# EasyEDA Pro project ProPrj_picoballoon-tracker_2025-08-19.epro

# Schematic Schematic1
Board Name: Board1; Create Date: 2025-05-16; Page Name: P1; Project Name: picoballoon-tracker; Schematic Name: Schematic1; Update Date: 2025-06-14; Company: EasyEDA.com; Page Size: A4; Version: V1.0
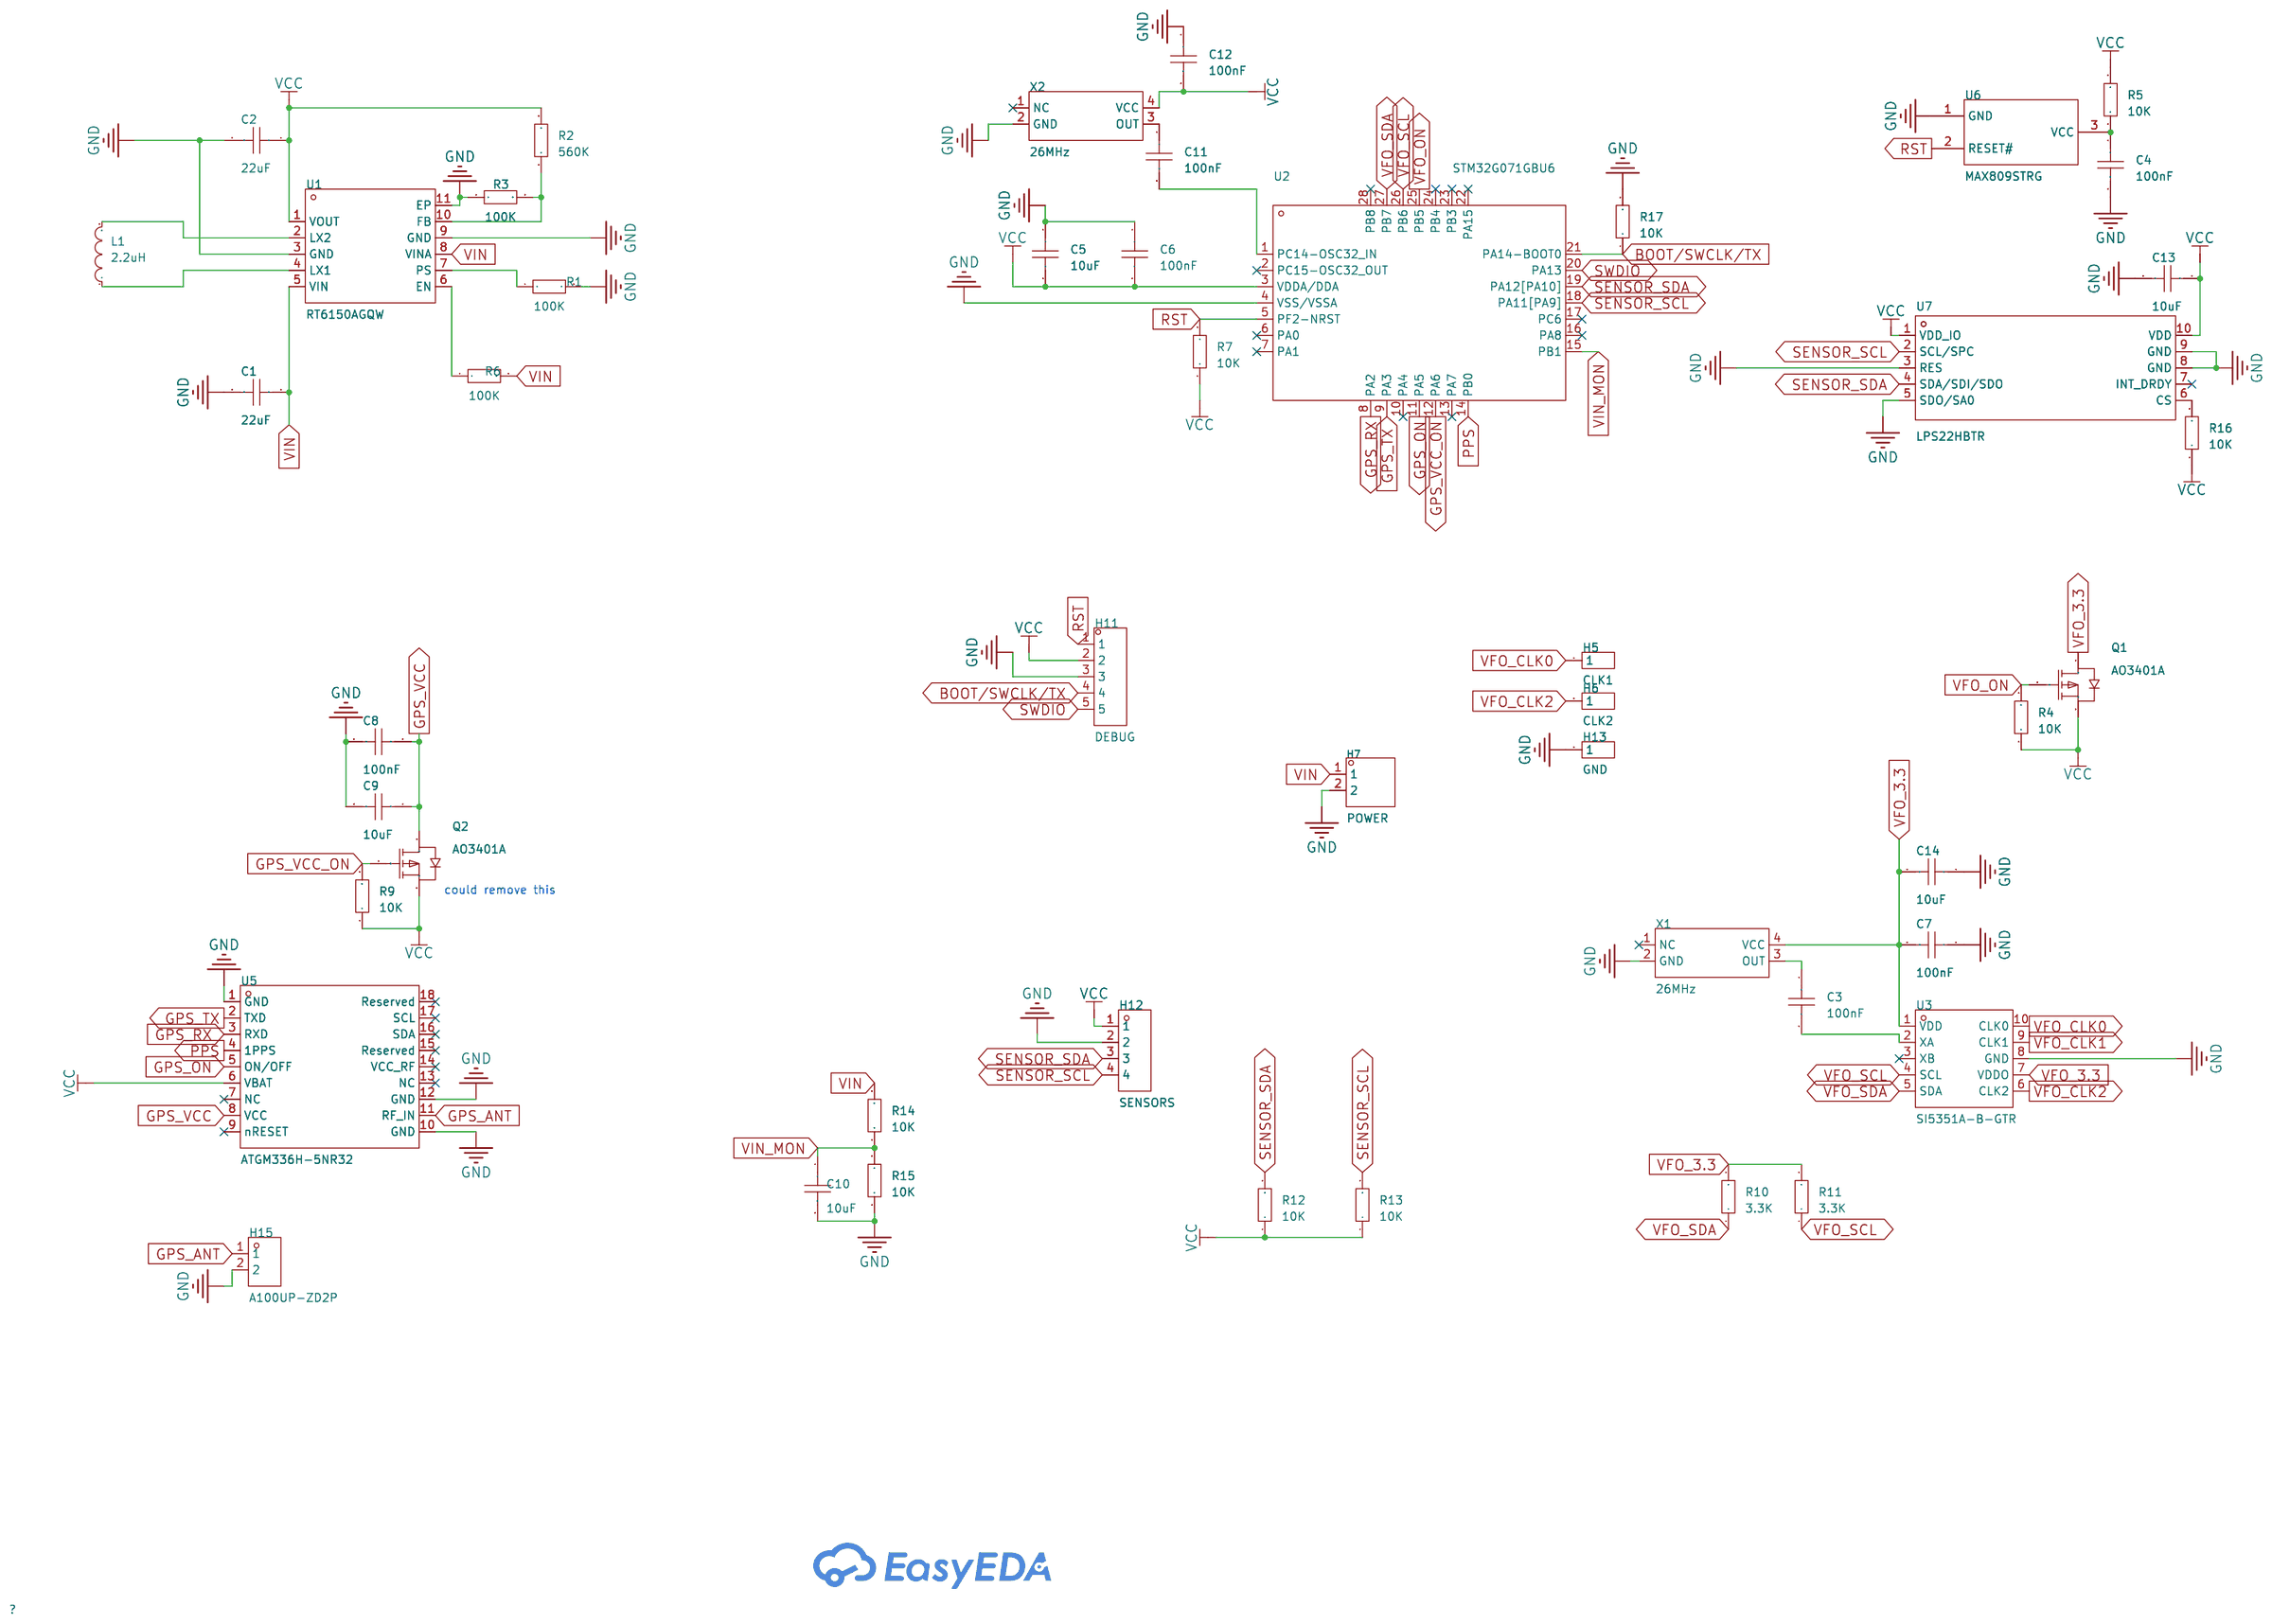
[diagram p0: schematic sheet]

## Parts
C1  22uF  [C0603]
C2  22uF  [C0603]
C3  100nF  [C0402]
C4  100nF  [C0402]
C5  10uF  [C0402]
C6  100nF  [C0402]
C7  100nF  [C0402]
C8  100nF  [C0402]
C9  10uF  [C0402]
C10  10uF  [C0402]
C11  100nF  [C0402]
C12  100nF  [C0402]
C13  10uF  [C0402]
C14  10uF  [C0402]
H5  CLK1  [HDR-TH_1P-V-M_XKB_X4611WV-01I-C28D40]
H6  CLK2  [HDR-TH_1P-V-M_XKB_X4611WV-01I-C28D40]
H7  POWER  [HDR-TH_2P-P2.54-V-M-1]
H11  DEBUG  [HDR-TH_5P-P2.54-V-M]
H12  SENSORS  [HDR-TH_ZX-PZ1.0-1-4PZZ]
H13  GND  [HDR-TH_1P-V-M_XKB_X4611WV-01I-C28D40]
H15  A100UP-ZD2P  [HDR-TH_2P-P1.00-V-M]
L1  2.2uH  [L0805]
Q1  AO3401A  [SOT-23_L2.9-W1.3-P1.90-LS2.4-BR]
Q2  AO3401A  [SOT-23_L2.9-W1.3-P1.90-LS2.4-BR]
R1  100K  [R0402]
R2  560K  [R0603]
R3  100K  [R0603]
R4  10K  [R0402]
R5  10K  [R0402]
R6  100K  [R0402]
R7  10K  [R0402]
R9  10K  [R0402]
R10  3.3K  [R0402]
R11  3.3K  [R0402]
R12  10K  [R0402]
R13  10K  [R0402]
R14  10K  [R0402]
R15  10K  [R0402]
R16  10K  [R0402]
R17  10K  [R0603]  (no BOM)
U1  RT6150AGQW  [WDFN-10_L3.0-W3.0-P0.50-BL-EP]
U2  STM32G071GBU6  [UFQFPN-28_L4.0-W4.0-P0.50-BL]
U3  SI5351A-B-GTR  [MSOP-10_L3.0-W3.0-P0.50-LS5.0-BL]
U5  ATGM336H-5NR32  [GPS-SMD_18P-L10.1-W9.7-P1.10-TL]
U6  MAX809STRG  [SOT-23-3_L2.9-W1.6-P1.90-LS2.8-BR]
U7  LPS22HBTR  [HLGA-10L_LPS22HBTR]
X1  26MHz  [OSC-SMD_4P-L2.5-W2.0-BL_X1G0042110003]
X2  26MHz  [OSC-SMD_4P-L2.5-W2.0-BL_X1G0042110003]

## Library data of the parts
C1 C2 = CAP_0603: Supplier Footprint: 0603
C3-C14 = CAP_0402: Supplier Part: C1525; Supplier Footprint: 0402
H5 H6 H13 = HDR-M_2.54_1x1P: Supplier Footprint: Through
H7 = HDR-M_2.54_1x2P: Supplier Footprint: Through
H11 = HDR-M_2.54_1x5P: Supplier Footprint: Through
H12 = ZX-PZ1.0-1-4PZZ: Pin Structure:1x4P Pitch:1mm Row Spacing:- Circluar Pins/Square Pins:Policy Mounting Type:Straight Number of Rows:Single Row Number of Pins:4P Current Rating:0.75A Length of Mating Pin:2mm Insulation Height:1mm Length of End Connection Pin:2mm Contact Mat; LCSC Part Name: 1x4P 间距:1mm 方针 直插; Supplier Part: C37328854; Manufacturer: Megastar(兆星); Supplier Footprint: 插件,P=1mm; JLCPCB Part Class: Extended Part; Datasheet: https://atta.szlcsc.com/upload/public/pdf/source/20240812/85F48A99F7C6AED78605DAA33CDE8A90.pdf; Supplier: LCSC; Pin Structure: 1x4P; Pitch: 1mm; Circluar Pins/Square Pins: Policy; Mounting Type: Straight; Number of Rows: Single Row; Number of Pins: 4P; Current Rating: 0.75A; Length of Mating Pin: 2mm; Insulation Height: 1mm; Length of End Connection Pin: 2mm; Contact Material: Brass; Contact Plating: Gold; Operating Temperature: -40℃~+105℃; Color: Black
H15 = A100UP-ZD2P: Pin Structure:1x2P Pitch:1mm Row Spacing:- Circluar Pins/Square Pins:Policy Number of Rows:Single Row Number of Pins:2P Current Rating:0.75A Length of Mating Pin:2mm Insulation Height:1mm Operating Temperature:-40℃~+105℃ Operating Temperature:-40℃~+105℃; LCSC Part Name: 1x2P 间距:1mm 方针; Supplier Part: C32713045; Manufacturer: BXCONN(宝讯); Supplier Footprint: 插件,P=1mm; JLCPCB Part Class: Extended Part; Datasheet: https://atta.szlcsc.com/upload/public/pdf/source/20240723/7827636EC4017AF937C0598DF75E6B3B.pdf; Supplier: LCSC; Pin Structure: 1x2P; Pitch: 1mm; Circluar Pins/Square Pins: Policy; Number of Rows: Single Row; Number of Pins: 2P; Current Rating: 0.75A; Length of Mating Pin: 2mm; Insulation Height: 1mm; Operating Temperature: -40℃~+105℃
L1 = L_0805
Q1 Q2 = AO3401A_C15127: Type:1 Piece P-Channel Drain Source Voltage (Vdss): Continuous Drain Current (Id): Drain Source On Resistance (RDS(on)@Vgs,Id):44mΩ@10V,4.3A Power Dissipation (Pd): Gate Threshold Voltage (Vgs(th)@Id):1.3V@250uA Total Gate Charge (Qg@Vgs):12.2nC@4.5V Inpu; LCSC Part Name: 1个P沟道 耐压:30V 电流:4A; Supplier Part: C15127; Manufacturer: AOS; Supplier Footprint: SOT-23; JLCPCB Part Class: Basic Part; Datasheet: https://atta.szlcsc.com/upload/public/pdf/source/20160507/1462613609053.pdf; Supplier: LCSC; Type: 1 Piece P-Channel; Drain Source On Resistance (RDS(on)@Vgs,Id): 44mΩ@10V,4.3A; Gate Threshold Voltage (Vgs(th)@Id): 1.3V@250uA; Total Gate Charge (Qg@Vgs): 12.2nC@4.5V; Input Capacitance (Ciss@Vds): 1.2nF@15V; Operating Temperature: -55℃~+150℃@(Tj)
R1 R4-R7 R9-R16 = Res_0402: Supplier Footprint: 0402
R2 R3 R17 = Res_0603: Supplier Footprint: 0603
U1 = RT6150AGQW: Function:Boost type Input Voltage:1.8V~5.5V Input Voltage:1.8V~5.5V Output Voltage:1.8V~5.5V Output Voltage:1.8V~5.5V Output Current:800mA Switching Frequency:1MHz Switching Frequency:1MHz Operating Temperature:-40℃~+125℃@(TJ) Operating Temperature:-40℃~+; Supplier Part: C147971; Manufacturer: RICHTEK(立锜); Supplier Footprint: WDFN-10-EP(3x3); JLCPCB Part Class: Extended Part; Datasheet: https://atta.szlcsc.com/upload/public/pdf/source/20180126/C147972_15169561259341309260.pdf; Supplier: LCSC; Function: Boost type; Input Voltage: 1.8V~5.5V; Output Voltage: 1.8V~5.5V; Output Current: 800mA; Switching Frequency: 1MHz; Operating Temperature: -40℃~+125℃@(TJ); Synchronous Rectification: Yes; Number of Outputs: 1; Topology: Step-down-Boost; Switch tube (built-in/external): Built-in
U2 = STM32G071GBU6: CPU Core:ARM-MSeries CPU Maximum Speed:64MHz Program Storage Size:128KB Program Memory Type:FLASH Number of I/O:26 ADC (Bit):12bit DAC (Bit):12bit Low Voltage Detection Threshold:1.71V~3.6V Low Voltage Detection Threshold:1.71V~3.6V Application Area:-; LCSC Part Name: 主流Arm Cortex-M0+ MCU，具有128 KB Flash存储器、36 KB RAM、64 MHz CPU、4x USART、定时器、ADC、DAC和通信接口，1.7-3.6V; Supplier Part: C529347; Manufacturer: ST(意法半导体); Supplier Footprint: UFQFPN-28(4x4); JLCPCB Part Class: Extended Part; Datasheet: https://atta.szlcsc.com/upload/public/pdf/source/20200511/C529341_B4645443CFA701032F4478EC9851D5EF.pdf; Supplier: LCSC; CPU Core: ARM-MSeries; CPU Maximum Speed: 64MHz; Program Storage Size: 128KB; Program Memory Type: FLASH; Number of I/O: 26; ADC (Bit): 12bit; DAC (Bit): 12bit; Low Voltage Detection Threshold: 1.71V~3.6V
U3 = SI5351A-B-GTR: Interface:I2C Output Frequency (Max):200MHz Supply Voltage:2.25V~3.6V Supply Voltage:2.25V~3.6V Input Low Voltage:990mV Input Low Voltage:990mV Intput High Voltage:1.75V~3.6V Intput High Voltage:1.75V~3.6V Output Low Voltage:600mV Output Low Voltage:600mV; Supplier Part: C504891; Manufacturer: SKYWORKS/SILICON LABS(芯科); Supplier Footprint: MSOP-10; JLCPCB Part Class: Extended Part; Datasheet: https://atta.szlcsc.com/upload/public/pdf/source/20201217/C504891_43D9F8D26F790B9DA481E85A362B0988.pdf; Supplier: LCSC; Interface: I2C; Output Frequency (Max): 200MHz; Supply Voltage: 2.25V~3.6V; Input Low Voltage: 990mV; Intput High Voltage: 1.75V~3.6V; Output Low Voltage: 600mV; Output High Voltage: 1.9V; Operating Temperatue: -55℃~+150℃
U5 = ATGM336H-5NR32: Supplier Part: C5117921; Manufacturer: 杭州中科微; Supplier Footprint: LCC-18(10.1x9.7); JLCPCB Part Class: Extended Part; Datasheet: https://atta.szlcsc.com/upload/public/pdf/source/20230625/BFC2F030748B2EE61697AE064B3C32F1.pdf; Supplier: LCSC
U6 = MAX809STRG: ChipType:Voltage monitor Output Type:Push-Pull Voltage - Supply:1V~5.5V Voltage - Supply:1V~5.5V Reset Active Level:Active Low Threshold Voltage:2.93V Number of Voltages Monitored:1 Manual Reset:No Watchdog:No Reset Timeout:140ms Operating Temperature:-40; Supplier Part: C9965; Manufacturer: onsemi(安森美); Supplier Footprint: SOT-23; JLCPCB Part Class: Extended Part; Datasheet: https://atta.szlcsc.com/upload/public/pdf/source/20170628/1498635293483.PDF; Supplier: LCSC; ChipType: Voltage monitor; Output Type: Push-Pull; Voltage - Supply: 1V~5.5V; Reset Active Level: Active Low; Threshold Voltage: 2.93V; Number of Voltages Monitored: 1; Manual Reset: No; Watchdog: No; Reset Timeout: 140ms; Operating Temperature: -40℃~+125℃@(TJ)
U7 = LPS22HBTR: Pressure range:26Kpa~126Kpa Pressure range:26Kpa~126Kpa The Power Supply Voltage:1.7V~3.6V The Power Supply Voltage:1.7V~3.6V Operating Temperature:-40℃~+85℃ Operating Temperature:-40℃~+85℃; Supplier Part: C94049; Manufacturer: ST(意法半导体); Supplier Footprint: HLGA-10(2x2); JLCPCB Part Class: Extended Part; Datasheet: https://atta.szlcsc.com/upload/public/pdf/source/20170908/C94049_1504870171328958154.pdf; Supplier: LCSC; Pressure range: 26Kpa~126Kpa; The Power Supply Voltage: 1.7V~3.6V; Operating Temperature: -40℃~+85℃
X1 X2 = X1G0042110003_C3013793: Frequency:26MHz Output Type:Peak Shaving Sine Wave Voltage - Supply:2.85V~3.15V Voltage - Supply:2.85V~3.15V Current - Supply:1.5mA Operating Temperature:-30℃~+85℃ Operating Temperature:-30℃~+85℃; LCSC Part Name: 26MHz 2.85V~3.15V; Supplier Part: C3013793; Manufacturer: EPSON(爱普生); Manufacturer Part: X1G0042110003; Supplier Footprint: SMD2520-6P; JLCPCB Part Class: Extended Part; Datasheet: https://atta.szlcsc.com/upload/public/pdf/source/20240417/EAF55A82FF3095CB5EF33A849766E589.pdf; Supplier: LCSC; Output Type: Peak Shaving Sine Wave; Voltage - Supply: 2.85V~3.15V; Current - Supply: 1.5mA; Operating Temperature: -30℃~+85℃

## Nets
GND: C1.2 C2.2 C4.2 C5.1 C6.1 C7.1 C8.2 C9.2 C10.2 C12.1 C13.2 C14.1 H7.2 H11.3 H12.2 H13.1 H15.2 R1.2 R3.1 R15.1 R17.2 U1.3(GND) U1.9(GND) U1.11(EP) U2.4(VSS/VSSA) U3.8(GND) U5.1(GND) U5.10(GND) U5.12(GND) U6.1(GND) U7.3(RES) U7.5(SDO/SA0) U7.8(GND) U7.9(GND) X1.2(GND) X2.2(GND)
VCC: C2.1 C5.2 C6.2 C12.2 C13.1 H11.2 H12.1 Q1.2(S) Q2.2(S) R2.2 R4.1 R5.2 R7.1 R9.1 R12.1 R13.1 R16.1 U1.1(VOUT) U2.3(VDDA/DDA) U5.6(VBAT) U7.1(VDD_IO) U7.10(VDD) X2.4(VCC)
VIN: C1.1 H7.1 R6.2 R14.2 U1.5(VIN) U1.8(VINA)
VIN_MON: C10.1 R14.1 R15.2 U2.15(PB1)
BOOT/SWCLK/TX: H11.4 R17.1 U2.21(PA14-BOOT0)
GPS_ANT: H15.1 U5.11(RF_IN)
GPS_ON: U2.11(PA5) U5.5(ON/OFF)
GPS_RX: U2.8(PA2) U5.3(RXD)
GPS_TX: U2.9(PA3) U5.2(TXD)
GPS_VCC: C8.1 C9.1 Q2.3(D) U5.8(VCC)
GPS_VCC_ON: Q2.1(G) R9.2 U2.12(PA6)
PPS: U2.14(PB0) U5.4(1PPS)
RST: H11.1 R7.2 U2.5(PF2-NRST) U6.2(RESET#)
SENSOR_SCL: H12.4 R13.2 U2.18(PA11[PA9]) U7.2(SCL/SPC)
SENSOR_SDA: H12.3 R12.2 U2.19(PA12[PA10]) U7.4(SDA/SDI/SDO)
SWDIO: H11.5 U2.20(PA13)
VFO_3.3: C7.2 C14.2 Q1.3(D) R10.2 R11.2 U3.1(VDD) U3.7(VDDO) X1.4(VCC)
VFO_CLK0: H5.1 U3.10(CLK0)
VFO_CLK1: U3.9(CLK1)
VFO_CLK2: H6.1 U3.6(CLK2)
VFO_ON: Q1.1(G) R4.2 U2.25(PB5)
VFO_SCL: R11.1 U2.26(PB6) U3.4(SCL)
VFO_SDA: R10.1 U2.27(PB7) U3.5(SDA)
$1N208: L1.2 U1.2(LX2)
$1N212: L1.1 U1.4(LX1)
$1N393: R6.1 U1.6(EN)
$1N419: R1.1 U1.7(PS)
$1N600: R2.1 R3.2 U1.10(FB)
$1N1023: C11.2 U2.1(PC14-OSC32_IN)
$1N1361: C3.1 X1.3(OUT)
$1N1366: C3.2 U3.2(XA)
$1N11250: C11.1 X2.3(OUT)
$1N13574: C4.1 R5.1 U6.3(VCC)
$1N14906: R16.2 U7.6(CS)

Not connected (* = marked no-connect by the designer): U2 2(PC15-OSC32_OUT)* 6(PA0)* 7(PA1)* 10(PA4)* 13(PA7)* 16(PA8)* 17(PC6)* 22(PA15)* 23(PB3)* 24(PB4)* 28(PB8)*; U3 3(XB)*; U5 7(NC)* 9(nRESET)* 13(NC)* 14(VCC_RF)* 15(Reserved)* 16(SDA)* 17(SCL)* 18(Reserved)*; U7 7(INT_DRDY)*; X1 1(NC)*; X2 1(NC)*

## Notes on the sheet
- could remove this

# Board PCB2
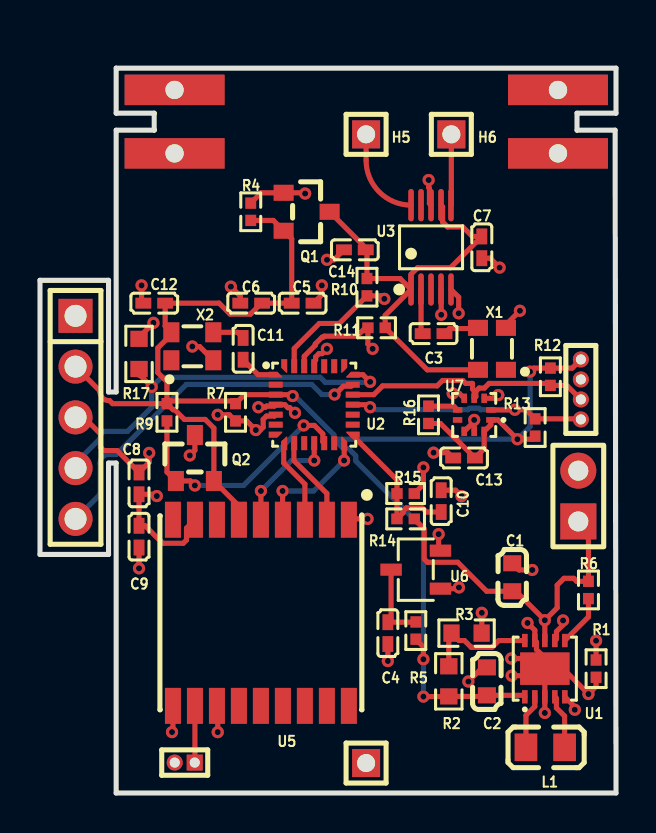
[diagram p1: board, top side]
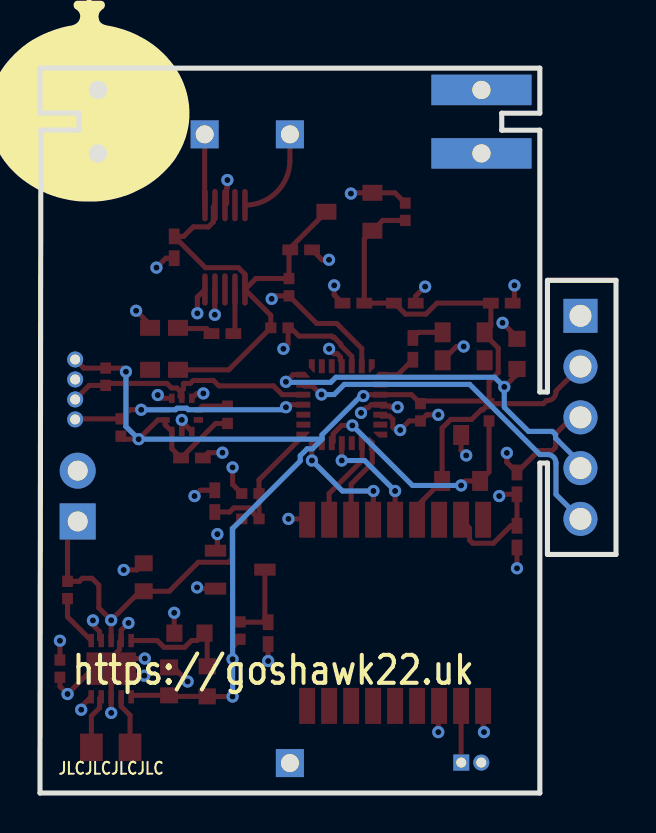
[diagram p2: board, bottom side, seen from below]

Outline 28.81 x 36.27 mm; copper layers: Top Layer, Inner1, Inner2, Bottom Layer. Coordinates in mm from the lower left corner of the outline.
Outline path: 0,25.65 0,11.94 3.43,11.94 3.43,16.51 3.81,16.51 3.81,0 28.81,0 28.77,33.17 26.86,33.17 26.86,34.02 28.81,34.02 28.81,36.27 3.81,36.27 3.81,34.02 5.72,34.02 5.72,33.17 3.81,33.17 3.81,20.07 3.43,20.07 3.43,25.65 0,25.65
Stack: Top Layer 0.035mm Outer layer thickness 1oz / Dielectric1 0.28mm 7628 RC49% 8.6mil / Inner1 0.035mm Inner layer thickness / Dielectric2 0.28mm 1.1mm H/HOZ Copper / Inner2 0.035mm Inner layer thickness / Dielectric3 0.28mm 7628 RC49% 8.6mil / Bottom Layer 0.035mm Outer layer thickness 1oz

## Design rules (mm)
template: JLCPCB Capability(Two Layers Board)
spacing copperThickness1oz (default): track to track 0.102, other pairs 0.152 to 0.3
spacing copperThickness2oz: track to track 0.203, other pairs 0.152 to 0.3
track width copperThickness1oz (default): min 0.127, default 0.254, max 2.54
track width copperThickness2oz: min 0.203, default 0.254, max 2.54
differential pair differentialPair (default): width min 0.127, default 0.254, max 2.54; gap min 0.152, default 0.152
via viaSize (default): diameter min 0.5, default 0.61, max 10; hole min 0.3, default 0.305, max 6.3

## Placement (name value [footprint] x y rotation side)
C1  22uF  [C0603]  23.62 10.8 90 top
C2  22uF  [C0603]  22.35 5.59 90 top
C3  100nF  [C0402]  19.69 22.99 180 top
C4  100nF  [C0402]  17.4 8 270 top
C5  10uF  [C0402]  13.14 24.51 180 top
C6  100nF  [C0402]  10.56 24.51 0 top
C7  100nF  [C0402]  22.1 27.31 90 top
C8  100nF  [C0402]  4.95 15.49 90 top
C9  10uF  [C0402]  4.95 12.83 270 top
C10  10uF  [C0402]  20.07 14.61 90 top
C11  100nF  [C0402]  10.16 22.22 270 top
C12  100nF  [C0402]  5.72 24.51 0 top
C13  10uF  [C0402]  21.21 16.76 180 top
C14  10uF  [C0402]  15.75 27.18 0 top
H5  CLK1  [HDR-TH_1P-V-M_XKB_X4611WV-01I-C28D40]  16.31 32.96 0 top
H6  CLK2  [HDR-TH_1P-V-M_XKB_X4611WV-01I-C28D40]  20.57 32.96 0 top
H7  POWER  [HDR-TH_2P-P2.54-V-M-1]  26.92 14.86 90 top
H11  DEBUG  [HDR-TH_5P-P2.54-V-M]  1.78 18.8 270 top
H12  SENSORS  [HDR-TH_ZX-PZ1.0-1-4PZZ]  27.05 20.19 270 top
H13  GND  [HDR-TH_1P-V-M_XKB_X4611WV-01I-C28D40]  16.31 1.5 0 top
H15  A100UP-ZD2P  [HDR-TH_2P-P1.00-V-M]  7.24 1.52 180 top
L1  2.2uH  [L0805]  25.27 2.29 180 top
NOREF  -  [Pad_e95]  6.73 35.18 0 top
NOREF#2  -  [Pad_e91]  25.91 32 0 top
NOREF#3  -  [Pad_e94]  25.91 35.18 0 top
NOREF#4  -  [Pad_e97]  6.73 32 0 top
Q1  AO3401A  [SOT-23_L2.9-W1.3-P1.90-LS2.4-BR]  13.34 29.08 180 top
Q2  AO3401A  [SOT-23_L2.9-W1.3-P1.90-LS2.4-BR]  7.75 16.76 270 top
R1  100K  [R0402]  27.81 6.22 270 top
R2  560K  [R0603]  20.45 5.59 270 top
R3  100K  [R0603]  21.34 8 180 top
R4  10K  [R0402]  10.54 29.08 90 top
R5  10K  [R0402]  18.8 8.13 270 top
R6  100K  [R0402]  27.43 10.16 90 top
R7  10K  [R0402]  9.78 19.05 270 top
R9  10K  [R0402]  6.35 19.05 270 top
R10  3.3K  [R0402]  16.35 25.31 90 top
R11  3.3K  [R0402]  16.83 23.28 0 top
R12  10K  [R0402]  25.53 20.83 270 top
R13  10K  [R0402]  24.77 18.29 90 top
R14  10K  [R0402]  18.29 13.72 0 top
R15  10K  [R0402]  18.29 14.99 180 top
R16  10K  [R0402]  19.43 18.92 90 top
R17  10K  [R0603]  4.95 21.97 90 top
U1  RT6150AGQW  [WDFN-10_L3.0-W3.0-P0.50-BL-EP]  25.25 6.22 0 top
U2  STM32G071GBU6  [UFQFPN-28_L4.0-W4.0-P0.50-BL]  13.72 19.43 270 top
U3  SI5351A-B-GTR  [MSOP-10_L3.0-W3.0-P0.50-LS5.0-BL]  19.56 27.31 0 top
U5  ATGM336H-5NR32  [GPS-SMD_18P-L10.1-W9.7-P1.10-TL]  11.05 9.02 270 top
U6  MAX809STRG  [SOT-23-3_L2.9-W1.6-P1.90-LS2.8-BR]  18.8 11.18 0 top
U7  LPS22HBTR  [HLGA-10L_LPS22HBTR]  21.72 18.92 180 top
X1  26MHz  [OSC-SMD_4P-L2.5-W2.0-BL_X1G0042110003]  22.61 22.22 90 top
X2  26MHz  [OSC-SMD_4P-L2.5-W2.0-BL_X1G0042110003]  7.62 22.35 0 top

## Footprints (pads in the part's own frame, mm; a bottom-side part is the same pattern mirrored in y, then rotated)
C0402
  rect 0.79x0.54 smd: 1(-0.545,0) 2(0.545,0)
C0603
  rect 0.8x0.9 smd: 1(-0.7,0) 2(0.7,0)
GPS-SMD_18P-L10.1-W9.7-P1.10-TL
  rect 1.8x0.8 smd: 1(-4.657,4.4) 2(-4.657,3.3) 3(-4.657,2.2) 4(-4.657,1.1) 5(-4.657,0) 6(-4.657,-1.1) 7(-4.657,-2.2) 8(-4.657,-3.3) 9(-4.657,-4.4) 10(4.657,-4.4) 11(4.657,-3.3) 12(4.657,-2.2) 13(4.657,-1.1) 14(4.657,0) 15(4.657,1.1) 16(4.657,2.2) 17(4.657,3.3) 18(4.657,4.4)
HDR-TH_1P-V-M_XKB_X4611WV-01I-C28D40
  rect 1.4x1.4 hole 0.9: 1(0,0)
HDR-TH_2P-P1.00-V-M
  rect 0.8x0.8 hole 0.5: 1(-0.5,0)
  round 0.8 hole 0.5: 2(0.5,0)
HDR-TH_2P-P2.54-V-M-1
  rect 1.8x1.8 hole 1: 1(-1.27,0)
  round 1.8 hole 1: 2(1.27,0)
HDR-TH_5P-P2.54-V-M
  rect 1.7x1.7 hole 1.1: 1(-5.08,0)
  round 1.7 hole 1.1: 2(-2.54,0) 3(0,0) 4(2.54,0) 5(5.08,0)
HDR-TH_ZX-PZ1.0-1-4PZZ
  round 0.8 hole 0.5: 1(-1.5,0) 2(-0.5,0) 3(0.5,0) 4(1.5,0)
HLGA-10L_LPS22HBTR
  rect 0.465x0.28 smd: 1(-0.833,0.255) 2(-0.833,-0.245) 6(0.833,-0.245) 7(0.833,0.255)
  rect 0.28x0.465 smd: 3(-0.5,-0.828) 4(0,-0.828) 5(0.5,-0.828) 8(0.5,0.828) 9(0,0.828) 10(-0.5,0.828)
L0805
  rect 1.133x1.377 smd: 1(-0.966,0) 2(0.966,0)
MSOP-10_L3.0-W3.0-P0.50-LS5.0-BL
  oval 0.28x1.62 smd: 1(-1,-2.11) 2(-0.5,-2.11) 3(0,-2.11) 4(0.5,-2.11) 5(1,-2.11) 6(1,2.11) 7(0.5,2.11) 8(0,2.11) 9(-0.5,2.11) 10(-1,2.11)
OSC-SMD_4P-L2.5-W2.0-BL_X1G0042110003
  rect 0.8x1 smd: 1(-1.05,-0.7) 2(1.05,-0.7) 3(1.05,0.7) 4(-1.05,0.7)
Pad_e91
  rect 5x1.524 hole 0.914: 1(0,0)
Pad_e94
  rect 5x1.524 hole 0.914: 1(0,0)
Pad_e95
  rect 5x1.524 hole 0.914: 1(0,0)
Pad_e97
  rect 5x1.524 hole 0.914: 1(0,0)
R0402
  rect 0.566x0.54 smd: 1(-0.433,0) 2(0.433,0)
R0603
  rect 0.806x0.864 smd: 1(-0.753,0) 2(0.753,0)
SOT-23-3_L2.9-W1.6-P1.90-LS2.8-BR
  rect 1.07x0.6 smd: 1(1.235,-0.95) 2(1.235,0.95) 3(-1.235,0)
SOT-23_L2.9-W1.3-P1.90-LS2.4-BR
  rect 1x0.8 smd: 1(1.15,-0.95) 2(1.15,0.95) 3(-1.15,0)
UFQFPN-28_L4.0-W4.0-P0.50-BL
  custom 0.3x0.675 smd: 1(-1.5,-1.875) 7(1.5,-1.875) 15(1.5,1.875) 21(-1.5,1.875)
  rect 0.3x0.7 smd: 2(-1,-1.925) 3(-0.5,-1.925) 4(0,-1.925) 5(0.5,-1.925) 6(1,-1.925) 16(1,1.925) 17(0.5,1.925) 18(0,1.925) 19(-0.5,1.925) 20(-1,1.925)
  custom 0.675x0.3 smd: 8(1.875,-1.5) 14(1.875,1.5) 22(-1.875,1.5) 28(-1.875,-1.5)
  rect 0.7x0.3 smd: 9(1.925,-1) 10(1.925,-0.5) 11(1.925,0) 12(1.925,0.5) 13(1.925,1) 24(-1.925,0.5) 25(-1.925,0) 26(-1.925,-0.5) 27(-1.925,-1)
  custom 0.7x0.3 smd: 23(-1.925,1)
WDFN-10_L3.0-W3.0-P0.50-BL-EP
  rect 0.28x0.665 smd: 1(-1,-1.407) 2(-0.5,-1.407) 3(0,-1.407) 4(0.5,-1.407) 5(1,-1.407) 6(1,1.407) 7(0.5,1.407) 8(0,1.407) 9(-0.5,1.407) 10(-1,1.407)
  rect 2.475x1.625 smd: 11(0,0)

## Nets
As in the schematic.

Pads without a net: NOREF 1; NOREF#2 1; NOREF#3 1; NOREF#4 1; U2 2 6 7 10 13 16 17 22 23 24 28; U3 3; U5 7 9 13 14 15 16 17 18; U7 7; X1 1; X2 1

## Via types
v1: diameter 0.61, hole 0.305, Top Layer to Bottom Layer, 63 vias

## Routing (per net, layer and track width the routed paths; a pad name or vN(x,y) marks a point on that pad's centre or on a via; arc(x,y) is an arc through that point)
GND: length 46.5
  Top Layer w0.254: v1(5.08,25.4) 5.08,24.6 C12.1 ; U6.1 20.89,10.23 v1(20.96,10.29) ; U5.1 15.49,13.72 v1(16.38,13.72) ; v1(22.99,26.29) 22.52,26.76 C7.1 ; U5.12 8.89,4.32 v1(8.89,3.05) ; v1(5.46,17.02) 5.46,16.55 C8.2 3.86,17.14 3.19,17.14 3.02,17.3 3.02,17.97 2.2,18.8 H11.3 ; C10.2 20.79,15.15 v1(21.08,14.86) ; U3.8 19.48,29.5 19.48,30.26 19.44,30.3 v1(19.44,30.67) ; U1.11 U1.3 v1(25.25,4.01) ; U1.11 25.25,6.76 24.83,7.18 24.83,7.55 U1.9 24.75,8.14 v1(24.38,8.51) ; U1.11 26.16,6.22 v1(27.43,4.95) 27.81,5.33 R1.2 ; U1.11 24.74,6.73 v1(23.57,6.73) ; U1.11 24.9,5.87 v1(23.59,5.87) ; C14.1 14.7,26.68 v1(14.35,26.68) ; C9.2 v1(4.95,11.24) ; X2.2 7.98,22.34 v1(7.62,22.34) ; R17.2 4.95,22.8 v1(5.68,23.53) ; v1(19.69,17.03) 20.4,17.03 C13.2 ; v1(12.75,19.02) 12.5,19.28 12.4,19.28 12.24,19.43 U2.4 11.72,19.36 11.33,19.36 11.27,19.3 v1(10.92,19.3) ; v1(24,24.13) 23.31,23.43 23.31,23.28 ; v1(22.1,9.02) 22.1,8.01 R3.1 ; R15.1 19.18,15.44 v1(19.18,16.29) ; C2.2 22.13,6.29 v1(21.43,5.58) ; U7.3 22.76,19.75 v1(22.92,19.91) ; 21.72,18.6 v1(21.72,18.67) ; 21.72,18.6 U7.9 ; 21.72,18.6 U7.8 ; v1(20.64,19.99) 20.97,19.99 U7.5 ; 13.68,24.51 14.1,24.93 v1(14.1,25.4) ; C4.2 v1(17.4,6.6) ; C1.2 23.96,11.16 v1(24.62,11.16) ; C6.1 10.02,24.87 v1(9.55,25.34) ; v1(6.6,3.05) 6.65,3.09 U5.10
VCC: length 85.9
  Top Layer w0.254: H11.2 3,20.11 3,20.07 arc(3.13,19.76) 3.43,19.64 3.47,19.64 3.63,19.48 R9.1 ; v1(19.18,6.69) 19.18,7.31 R5.2 ; R16.1 20.03,18.49 C13.1 22.22,17.23 U7.10 22.55,18.43 U7.1 22.91,18.67 v1(23.88,17.7) 24.61,17.7 24.77,17.86 ; v1(12.64,19.86) 12.57,19.93 U2.3 10.23,19.93 R7.1 9.65,19.62 6.48,19.62 R9.1 ; R9.1 6.35,20.58 5.89,21.04 5.89,22.27 6.35,22.73 6.35,22.83 X2.4 6.26,23.36 C12.2 8.96,24.51 9.51,23.96 10.53,23.96 11.08,24.51 C6.2 C5.2 12.59,27.73 Q1.2 11.67,28.65 R4.1 ; R9.1 6.65,19.18 6.74,19.18 7.22,18.69 8.26,18.69 8.7,18.26 Q2.2 9.95,14.36 U5.6 ; U1.1 24.18,4.89 C2.1 22.3,4.83 R2.2 20.44,4.83 v1(19.18,4.83) ; H12.1 26.62,21.26 24.69,21.26 v1(24.51,21.08)
  Bottom Layer w0.254: 14.7,17.7 v1(23.88,17.7) 24.51,18.34 v1(24.51,21.08) ; 14.7,17.7 14.7,17.92 12.76,19.86 v1(12.64,19.86) ; 14.7,17.7 15.19,17.22 15.45,17.22 15.79,16.88 15.79,16.61 19.18,13.23 v1(19.18,6.69) v1(19.18,4.83)
VIN: length 23.5
  Top Layer w0.254: U1.5 26.75,4.32 v1(26.75,4.17) ; H7.1 27.43,13.08 R6.2 26.84,10.59 26.69,10.74 26.21,10.74 25.87,10.4 25.87,9.26 v1(25.25,8.65) ; R14.2 19.22,13.22 19.22,11.71 19.38,11.55 20.89,11.55 22.34,10.09 C1.1 23.8,10.09 v1(25.25,8.65) ; v1(25.25,8.65) U1.8
  Inner2 w0.254: v1(26.75,4.17) 26.75,7.15 v1(25.25,8.65)
VIN_MON: length 7.7
  Top Layer w0.254: U2.15 17.85,15.67 17.85,13.72 18.16,14.02 18.16,14.1 18.32,14.27 19.12,14.27 19.32,14.06 C10.1
BOOT/SWCLK/TX: length 19.5
  Top Layer w0.254: v1(16.51,20.57) 16.15,20.93 U2.21 ; v1(5.59,20.32) 5,20.9 4.95,20.9
  Bottom Layer w0.254: v1(16.51,20.57) 16.49,20.55 14.27,20.55 14.01,20.8 6.07,20.8 v1(5.59,20.32) 5.59,19.3 4.38,18.09 3.19,18.09 3.02,17.93 3.02,17.75 1.78,16.51 H11.4
GPS_ANT: length 2.8
  Top Layer w0.254: U5.11 7.75,1.53 H15.1
GPS_ON: length 5.6
  Top Layer w0.254: U5.5 v1(11.05,15.11) ; U2.11 v1(13.72,16.64)
  Bottom Layer w0.254: v1(13.72,16.64) 12.57,16.64 v1(11.05,15.11)
GPS_RX: length 4.3
  Top Layer w0.254: U2.8 12.19,17.53 12.19,16.51 13.25,15.45 U5.3
GPS_TX: length 4.5
  Top Layer w0.254: U5.2 14.35,14.99 12.7,16.64 12.7,17.49 U2.9
GPS_VCC: length 10.3
  Top Layer w0.254: U5.8 7.33,13.25 7.33,12.66 7.16,12.5 6.13,12.5 5.26,13.37 C9.1 C8.1 5.75,14.95 v1(5.84,14.86) ; Q2.3 7.75,17.14 v1(7.49,16.89)
  Inner2 w0.254: v1(5.84,14.86) 7.49,16.51 v1(7.49,16.89)
GPS_VCC_ON: length 12.5
  Top Layer w0.254: v1(7.75,15.39) 7.52,15.61 Q2.1 6.35,16.06 R9.2 ; v1(13.19,18.39) 13.72,18.39 14.15,17.97 14.15,17.58 U2.12
  Bottom Layer w0.254: v1(13.19,18.39) 10.18,15.39 v1(7.75,15.39)
PPS: length 6.1
  Top Layer w0.254: v1(12.13,15.11) 12.13,13.69 U5.4 ; U2.14 15.22,16.64 v1(15.21,16.64)
  Bottom Layer w0.254: v1(15.21,16.64) 13.69,15.11 v1(12.13,15.11)
RST: length 26.7
  Top Layer w0.254: v1(8.89,18.92) 9.39,18.92 9.39,18.92 9.47,18.92 R7.2 10.34,18.62 v1(10.8,18.16) 11.02,18.16 11.16,18.3 11.16,18.7 11.33,18.86 11.72,18.86 U2.5 ; U6.2 19.94,12.22 v1(19.94,12.95)
  Inner2 w0.254: v1(19.94,12.95) 16,12.95 v1(10.8,18.16) ; v1(8.89,18.92) 6.73,18.92 6.02,19.64 3.43,19.64 arc(3.13,19.76) 3,20.07 3,22.65 H11.1
SENSOR_SCL: length 13
  Top Layer w0.254: U7.2 23.74,19.17 v1(23.75,19.18) 24.31,19.18 R13.2 27.02,18.72 H12.4 ; U2.18 16.38,19.43 v1(16.51,19.3)
  Bottom Layer w0.254: v1(23.75,19.18) 22.03,19.18 21.96,19.25 21.47,19.25 21.4,19.18 16.64,19.18 v1(16.51,19.3)
SENSOR_SDA: length 13.3
  Top Layer w0.254: U2.19 16.69,19.93 17.13,20.37 19.86,20.37 20.13,20.64 21.14,20.64 21.29,20.5 21.62,20.5 21.64,20.48 21.64,20.21 21.72,20.13 U7.4 21.8,19.83 21.8,20.1 21.96,20.26 22.23,20.26 22.46,20.5 25.43,20.5 R12.2 26.35,20.39 H12.3
SWDIO: length 18.1
  Top Layer w0.254: v1(14.73,19.94) 14.75,19.94 15.18,20.36 15.57,20.36 U2.20
  Bottom Layer w0.254: H11.5 3,14.94 3,16.51 arc(3.13,16.81) 3.43,16.94 3.81,16.94 7.32,20.45 13.59,20.45 14.1,19.94 v1(14.73,19.94)
VFO_3.3: length 22.7
  Top Layer w0.254: U3.1 18.56,25.96 18.88,26.28 20.53,26.28 C7.2 21.62,27.85 21.15,28.33 20.38,28.33 20.14,28.57 20.14,29.33 U3.7 ; U3.1 18.01,25.74 16.35,25.74 16.35,27.21 Q1.3 ; U3.1 17.27,23.9 R11.2 19.37,21.17 X1.4
VFO_CLK0: length 4.8
  Top Layer w0.254: H5.1 16.31,31.66 arc(16.97,30.07) U3.10
VFO_CLK2: length 3.5
  Top Layer w0.254: H6.1 20.57,29.43 U3.6
VFO_ON: length 12.4
  Top Layer w0.254: v1(14.35,22.22) 14.11,21.98 13.95,21.98 13.79,21.82 13.79,21.66 13.72,21.59 U2.25 ; R4.2 11.06,30.03 Q1.1 13.22,30.03 v1(13.26,29.99)
  Inner2 w0.254: v1(14.35,22.22) 13.26,23.32 v1(13.26,29.99)
VFO_SCL: length 10.9
  Top Layer w0.254: v1(16.64,22.22) 16.4,22.46 R11.1 16.27,23.28 15.86,22.86 14.22,22.86 14.17,22.81 14.11,22.81 13.77,22.47 13.77,22.4 13.22,21.85 U2.26 ; U3.4 20.07,25.19 v1(20.07,23.93)
  Inner2 w0.254: v1(16.64,22.22) 18.36,22.22 v1(20.07,23.93)
VFO_SDA: length 11.9
  Top Layer w0.254: v1(17.22,24.72) 17.07,24.88 R10.1 14.97,23.5 13.97,23.5 12.72,22.24 U2.27 ; U3.5 20.94,24.81 v1(20.94,24)
  Inner2 w0.254: v1(20.94,24) 20.22,24.72 v1(17.22,24.72)
$1N208: length 2.7
  Top Layer w0.254: U1.2 24.75,4.33 24.31,3.89 L1.2
$1N212: length 2.7
  Top Layer w0.254: L1.1 26.24,3.85 25.83,4.26 25.83,4.73 U1.4
$1N393: length 2.6
  Top Layer w0.254: U1.6 27.43,8.81 27.43,9.73
$1N419: length 4.2
  Top Layer w0.254: v1(26.16,8.64) 26.16,8.41 25.83,8.08 25.83,7.71 U1.7 ; R1.1 v1(27.81,7.62)
  Inner2 w0.254: v1(26.16,8.64) 27.18,7.62 v1(27.81,7.62)
$1N600: length 5.8
  Top Layer w0.254: U1.10 22.95,7.63 22.61,7.29 21.57,7.29 21.23,7.63 20.95,7.63 R3.2 20.45,7.87 R2.1
$1N1023: length 2
  Top Layer w0.254: C11.2 10.91,20.93 U2.1
$1N1361: length 1.8
  Top Layer w0.254: C3.1 20.48,23.24 21.87,23.24 21.91,23.28
$1N1366: length 2.2
  Top Layer w0.254: C3.2 19.06,23.07 U3.2
$1N11250: length 1.6
  Top Layer w0.254: C11.1 9.88,23.05 X2.3
$1N13574: length 4.1
  Top Layer w0.254: R5.1 18.78,8.55 C4.1 17.56,8.71 17.56,11.18
$1N14906: length 1.5
  Top Layer w0.254: R16.2 20.7,19.36 U7.6

## Copper pours and planes (outline as drawn; the poured copper is in the pictures)
GND on Inner1: 3.81,35 28.81,35 28.81,0 3.81,0

## Text on the board
Bottom Silkscreen Layer: JLCJLCJLCJLC | https://goshawk22.uk
